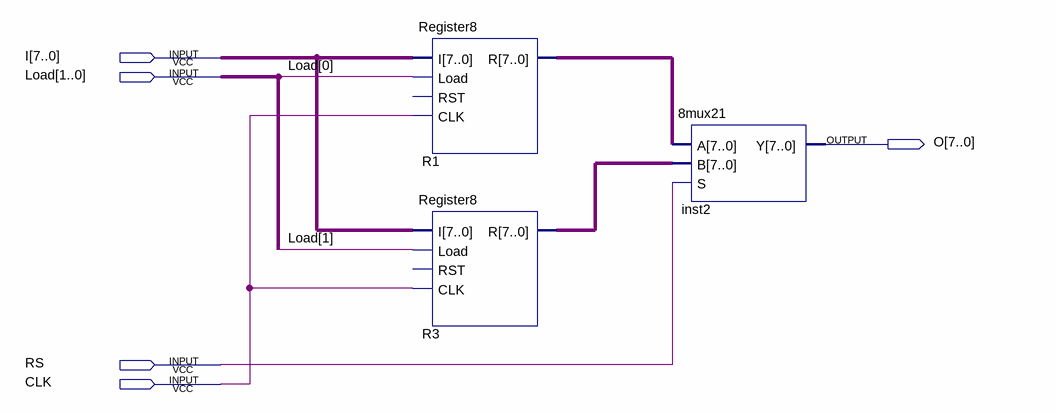
[diagram p0: schematic sheet]
// Quartus schematic RF13.bdf as structural Verilog: 3 symbols, 5 pins
module RF13 (
  input  [7:0] I,
  input  [1:0] Load,
  input  RS,
  input  CLK,
  output [7:0] O
);

  wire [7:0] R1_r, R3_r;

  Register8 R1 (.I(I), .Load(Load[0]), .CLK(CLK), .R(R1_r));  // open: RST
  Register8 R3 (.I(I), .Load(Load[1]), .CLK(CLK), .R(R3_r));  // open: RST
  \8mux21  inst2 (.A(R1_r), .B(R3_r), .S(RS), .Y(O));
endmodule
